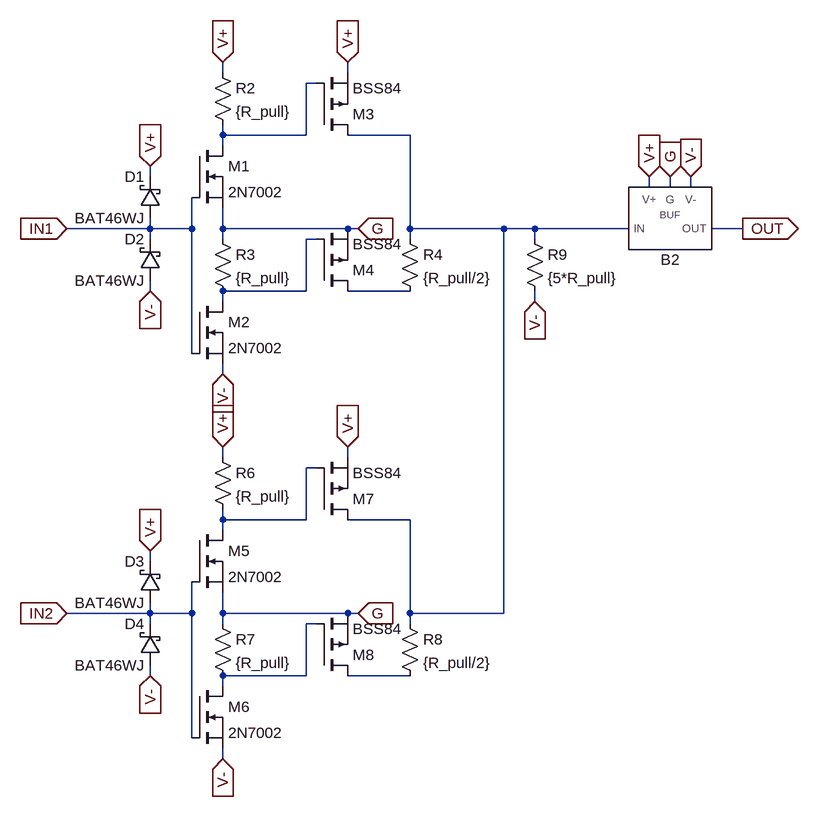
[diagram p0: schematic tri_max1.asc]
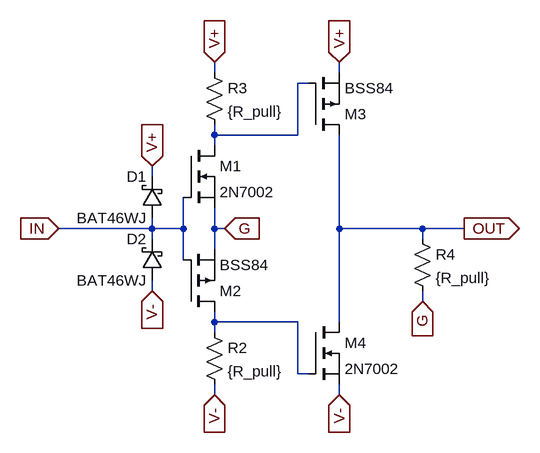
[diagram p1: sub-circuit tri_buffer1.asc]
tri_max1.asc, the LTspice schematic file:
Version 4
SHEET 1 1036 1124
WIRE 32 -32 32 -48
WIRE 224 -32 224 -48
WIRE 176 -16 160 -16
WIRE 32 64 32 48
WIRE 160 64 160 -16
WIRE 160 64 32 64
WIRE 320 64 224 64
WIRE 32 80 32 64
WIRE -80 128 -80 112
WIRE 688 144 688 128
WIRE 720 144 720 128
WIRE 752 144 752 128
WIRE -80 208 -80 192
WIRE -80 208 -208 208
WIRE -16 208 -16 160
WIRE -16 208 -80 208
WIRE 32 208 32 176
WIRE 224 208 32 208
WIRE 240 208 224 208
WIRE 320 208 320 64
WIRE 464 208 320 208
WIRE 512 208 464 208
WIRE 656 208 512 208
WIRE 832 208 784 208
WIRE -80 224 -80 208
WIRE 32 224 32 208
WIRE 176 224 160 224
WIRE 320 224 320 208
WIRE 512 224 512 208
WIRE -80 304 -80 288
WIRE 160 304 160 224
WIRE 160 304 32 304
WIRE 320 304 224 304
WIRE 32 320 32 304
WIRE 512 320 512 304
WIRE -16 400 -16 208
WIRE 32 432 32 416
WIRE 32 560 32 544
WIRE 224 560 224 544
WIRE 176 576 160 576
WIRE 32 656 32 640
WIRE 160 656 160 576
WIRE 160 656 32 656
WIRE 320 656 224 656
WIRE 32 672 32 656
WIRE -80 720 -80 704
WIRE -80 800 -80 784
WIRE -80 800 -208 800
WIRE -16 800 -16 752
WIRE -16 800 -80 800
WIRE 32 800 32 768
WIRE 224 800 32 800
WIRE 240 800 224 800
WIRE 320 800 320 656
WIRE 464 800 464 208
WIRE 464 800 320 800
WIRE -80 816 -80 800
WIRE 32 816 32 800
WIRE 176 816 160 816
WIRE 320 816 320 800
WIRE -80 896 -80 880
WIRE 160 896 160 816
WIRE 160 896 32 896
WIRE 320 896 224 896
WIRE 32 912 32 896
WIRE -16 992 -16 800
WIRE 32 1024 32 1008
FLAG -208 208 IN1
IOPIN -208 208 In
FLAG 832 208 OUT
IOPIN 832 208 Out
FLAG -208 800 IN2
IOPIN -208 800 In
FLAG 720 128 G
IOPIN 720 128 In
FLAG 32 -48 V+
IOPIN 32 -48 In
FLAG -80 112 V+
IOPIN -80 112 In
FLAG 688 128 V+
IOPIN 688 128 In
FLAG 32 544 V+
IOPIN 32 544 In
FLAG -80 704 V+
IOPIN -80 704 In
FLAG 32 1024 V-
IOPIN 32 1024 In
FLAG -80 896 V-
IOPIN -80 896 In
FLAG -80 304 V-
IOPIN -80 304 In
FLAG 32 432 V-
IOPIN 32 432 In
FLAG 512 320 V-
IOPIN 512 320 In
FLAG 752 128 V-
IOPIN 752 128 In
FLAG 240 208 G
IOPIN 240 208 In
FLAG 240 800 G
IOPIN 240 800 In
FLAG 224 -48 V+
IOPIN 224 -48 In
FLAG 224 544 V+
IOPIN 224 544 In
SYMBOL nmos -16 80 R0
SYMATTR InstName M1
SYMATTR Value 2N7002
SYMBOL schottky -64 192 R180
WINDOW 0 24 64 Left 2
WINDOW 3 24 0 Left 2
SYMATTR InstName D1
SYMATTR Value BAT46WJ
SYMATTR Description Diode
SYMATTR Type diode
SYMBOL schottky -64 288 R180
WINDOW 0 24 64 Left 2
WINDOW 3 24 0 Left 2
SYMATTR InstName D2
SYMATTR Value BAT46WJ
SYMATTR Description Diode
SYMATTR Type diode
SYMBOL res 16 -48 R0
SYMATTR InstName R2
SYMATTR Value {R_pull}
SYMBOL pmos 176 64 M180
SYMATTR InstName M3
SYMATTR Value BSS84
SYMBOL res 496 208 R0
SYMATTR InstName R9
SYMATTR Value {5*R_pull}
SYMBOL res 16 208 R0
SYMATTR InstName R3
SYMATTR Value {R_pull}
SYMBOL pmos 176 304 M180
SYMATTR InstName M4
SYMATTR Value BSS84
SYMBOL res 304 208 R0
SYMATTR InstName R4
SYMATTR Value {R_pull/2}
SYMBOL nmos -16 320 R0
SYMATTR InstName M2
SYMATTR Value 2N7002
SYMBOL nmos -16 672 R0
SYMATTR InstName M5
SYMATTR Value 2N7002
SYMBOL schottky -64 784 R180
WINDOW 0 24 64 Left 2
WINDOW 3 24 0 Left 2
SYMATTR InstName D3
SYMATTR Value BAT46WJ
SYMATTR Description Diode
SYMATTR Type diode
SYMBOL schottky -64 880 R180
WINDOW 0 24 64 Left 2
WINDOW 3 24 0 Left 2
SYMATTR InstName D4
SYMATTR Value BAT46WJ
SYMATTR Description Diode
SYMATTR Type diode
SYMBOL res 16 544 R0
SYMATTR InstName R6
SYMATTR Value {R_pull}
SYMBOL pmos 176 656 M180
SYMATTR InstName M7
SYMATTR Value BSS84
SYMBOL res 16 800 R0
SYMATTR InstName R7
SYMATTR Value {R_pull}
SYMBOL pmos 176 896 M180
SYMATTR InstName M8
SYMATTR Value BSS84
SYMBOL res 304 800 R0
SYMATTR InstName R8
SYMATTR Value {R_pull/2}
SYMBOL nmos -16 912 R0
SYMATTR InstName M6
SYMATTR Value 2N7002
SYMBOL tri_buffer1 720 208 R0
SYMATTR InstName B2

tri_buffer1.asc, the sub-circuit schematic file:
Version 4
SHEET 1 880 680
WIRE 32 -32 32 -48
WIRE 224 -32 224 -48
WIRE 176 -16 160 -16
WIRE 32 64 32 48
WIRE 160 64 160 -16
WIRE 160 64 32 64
WIRE 32 80 32 64
WIRE -64 128 -64 112
WIRE -64 208 -64 192
WIRE -64 208 -208 208
WIRE -16 208 -16 160
WIRE -16 208 -64 208
WIRE 32 208 32 176
WIRE 48 208 32 208
WIRE 224 208 224 64
WIRE 352 208 224 208
WIRE 416 208 352 208
WIRE -64 224 -64 208
WIRE 352 224 352 208
WIRE 32 240 32 208
WIRE -16 256 -16 208
WIRE -64 304 -64 288
WIRE 352 320 352 304
WIRE 32 352 32 336
WIRE 160 352 32 352
WIRE 224 352 224 208
WIRE 32 368 32 352
WIRE 160 432 160 352
WIRE 176 432 160 432
WIRE 32 464 32 448
WIRE 224 464 224 448
FLAG 224 -48 V+
IOPIN 224 -48 In
FLAG -64 304 V-
IOPIN -64 304 In
FLAG 352 320 G
IOPIN 352 320 In
FLAG -208 208 IN
IOPIN -208 208 In
FLAG 416 208 OUT
IOPIN 416 208 Out
FLAG 32 -48 V+
IOPIN 32 -48 In
FLAG -64 112 V+
IOPIN -64 112 In
FLAG 32 464 V-
IOPIN 32 464 In
FLAG 224 464 V-
IOPIN 224 464 In
FLAG 48 208 G
IOPIN 48 208 In
SYMBOL nmos -16 80 R0
SYMATTR InstName M1
SYMATTR Value 2N7002
SYMBOL pmos -16 336 M180
SYMATTR InstName M2
SYMATTR Value BSS84
SYMBOL schottky -48 192 R180
WINDOW 0 24 64 Left 2
WINDOW 3 24 0 Left 2
SYMATTR InstName D1
SYMATTR Value BAT46WJ
SYMATTR Description Diode
SYMATTR Type diode
SYMBOL schottky -48 288 R180
WINDOW 0 24 64 Left 2
WINDOW 3 24 0 Left 2
SYMATTR InstName D2
SYMATTR Value BAT46WJ
SYMATTR Description Diode
SYMATTR Type diode
SYMBOL res 16 352 R0
SYMATTR InstName R2
SYMATTR Value {R_pull}
SYMBOL res 16 -48 R0
SYMATTR InstName R3
SYMATTR Value {R_pull}
SYMBOL pmos 176 64 M180
SYMATTR InstName M3
SYMATTR Value BSS84
SYMBOL nmos 176 352 R0
SYMATTR InstName M4
SYMATTR Value 2N7002
SYMBOL res 336 208 R0
SYMATTR InstName R4
SYMATTR Value {R_pull}

The netlist it stands for:
* tri_max1.asc
M1 N001 IN1 G G 2N7002
D1 IN1 V+ BAT46WJ
D2 V- IN1 BAT46WJ
R2 V+ N001 {R_pull}
M3 N002 N001 V+ V+ BSS84
R9 N002 V- {5*R_pull}
R3 G N003 {R_pull}
M4 N004 N003 G G BSS84
R4 N002 N004 {R_pull/2}
M2 N003 IN1 V- V- 2N7002
M5 N005 IN2 G G 2N7002
D3 IN2 V+ BAT46WJ
D4 V- IN2 BAT46WJ
R6 V+ N005 {R_pull}
M7 N002 N005 V+ V+ BSS84
R7 G N006 {R_pull}
M8 N007 N006 G G BSS84
R8 N002 N007 {R_pull/2}
M6 N006 IN2 V- V- 2N7002
XB2 V+ V- N002 OUT G tri_buffer1

* block symbol definitions
.subckt tri_buffer1 V+ V- IN OUT G
M1 N001 IN G G 2N7002
M2 N002 IN G G BSS84
D1 IN V+ BAT46WJ
D2 V- IN BAT46WJ
R2 N002 V- {R_pull}
R3 V+ N001 {R_pull}
M3 OUT N001 V+ V+ BSS84
M4 OUT N002 V- V- 2N7002
R4 OUT G {R_pull}
.ends tri_buffer1

.model D D
.lib standard.dio
.model NMOS NMOS
.model PMOS PMOS
.lib standard.mos
.backanno
.end